# Altium project PCB_Project1.PrjPCB
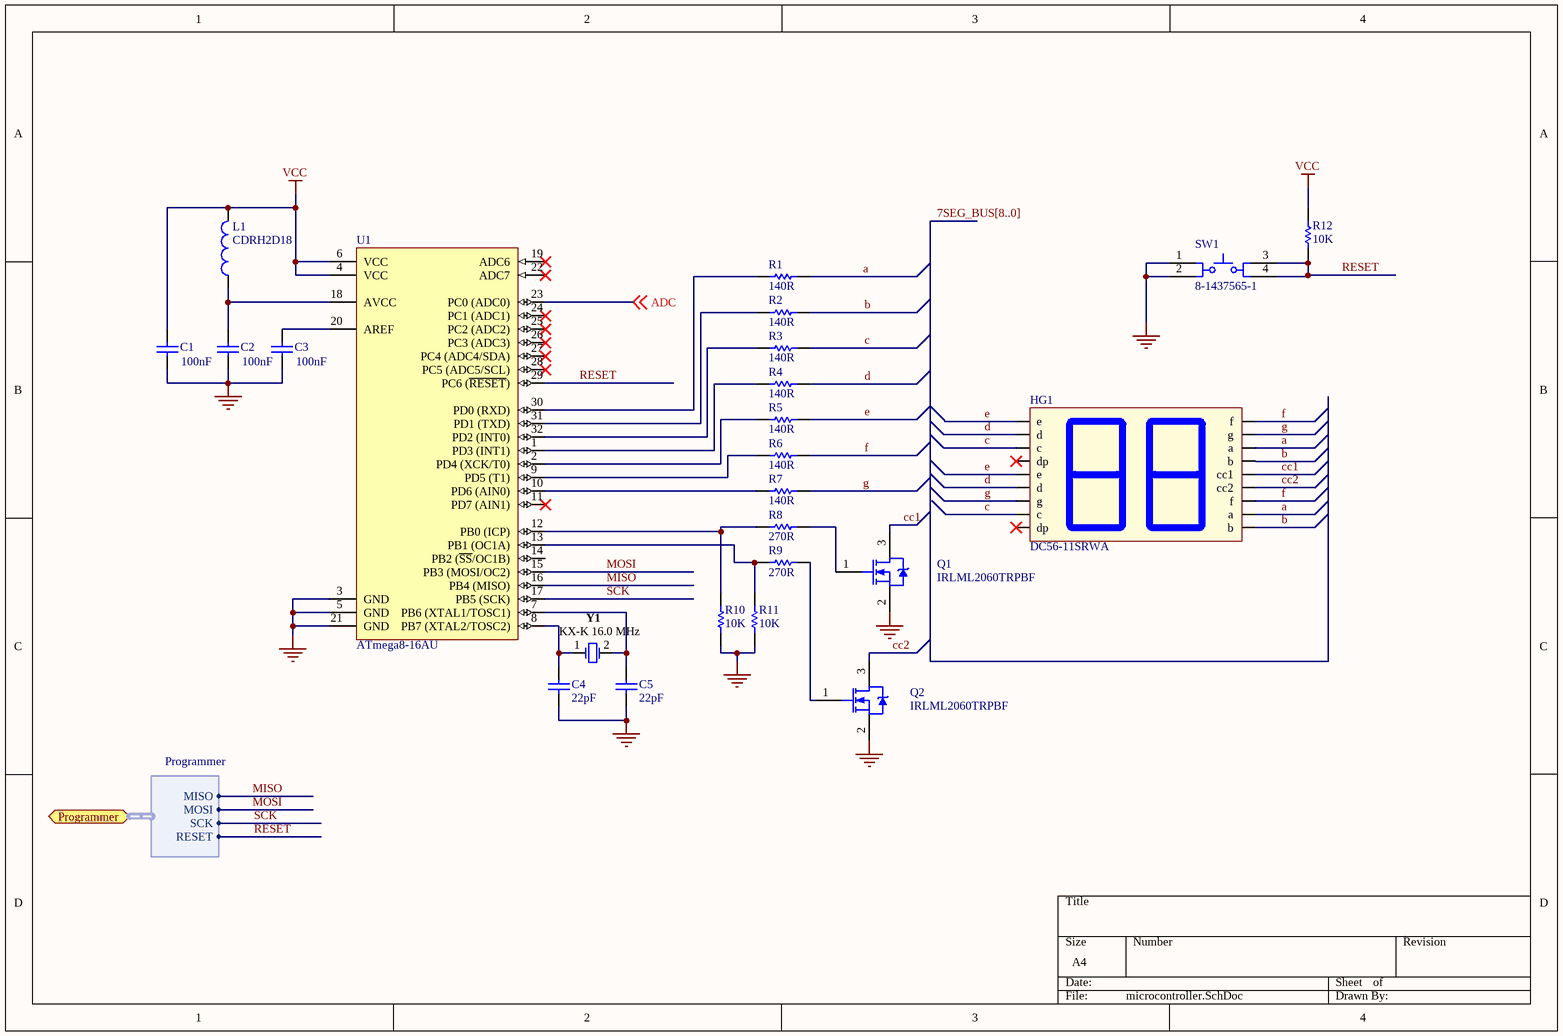
[diagram p0: microcontroller.SchDoc]
4 sheets, 38 parts. Net scope: flat (ports and power ports of the same name join across sheets).
Board file: PCB1.PcbDoc
Sheets:
  microcontroller.SchDoc
  OA.SchDoc
  pm.SchDoc
  programmer.SchDoc

## Sheet microcontroller.SchDoc
size A4

### Parts
C1  100nF  [CAPC0805(2012)75_M]
C2  100nF  [CAPC0805(2012)75_M]
C3  100nF  [CAPC0805(2012)75_M]
C4  22pF  [CAPC0805(2012)100_M]
C5  22pF  [CAPC0805(2012)100_M]
HG1  DC56-11SRWA  [7seg_LCD]
L1  CDRH2D18  [SUMI-CDRH2D14NP-1R5NC-2_V]
Q1  IRLML2060TRPBF  [INTR-IRLML2402TRPBF-3_V]
Q2  IRLML2060TRPBF  [INTR-IRLML2402TRPBF-3_V]
R1  140R  [RESC0805(2012)_M]
R2  140R  [RESC0805(2012)_M]
R3  140R  [RESC0805(2012)_M]
R4  140R  [RESC0805(2012)_M]
R5  140R  [RESC0805(2012)_M]
R6  140R  [RESC0805(2012)_M]
R7  140R  [RESC0805(2012)_M]
R8  270R  [RESC0805(2012)_M]
R9  270R  [RESC0805(2012)_M]
R10  10K  [RESC0805(2012)_M]
R11  10K  [RESC0805(2012)_M]
R12  10K  [RESC0805(2012)_M]
SW1  8-1437565-1  [SW-SPST-NO-4]
U1  ATmega8-16AU  [32A_L]
Y1  KX-K 16.0 MHz  [FOX-HC49SDLF_V]

### Ports
Programmer (harness Programmer)

### Harnesses
Programmer: MISO, MOSI, SCK, RESET

### Nets
GND: C1.1 C2.1 C3.1 C4.1 C5.1 Q1.2(S) Q2.2(S) R10.1 R11.1 SW1.1 SW1.2 U1.3(GND) U1.5(GND) U1.21(GND)
VCC: C1.2 L1.2 R12.2 U1.4(VCC) U1.6(VCC)
a: HG1.11(a) HG1.16(a) R1.2
ADC: U1.23(PC0_(ADC0)) ; off-sheet ADC
b: HG1.10(b) HG1.15(b) R2.2
c: HG1.3(c) HG1.8(c) R3.2
cc1: HG1.14(cc1) Q1.3(D)
cc2: HG1.13(cc2) Q2.3(D)
d: HG1.2(d) HG1.6(d) R4.2
e: HG1.1(e) HG1.5(e) R5.2
f: HG1.12(f) HG1.18(f) R6.2
g: HG1.7(g) HG1.17(g) R7.2
MISO: U1.16(PB4_(MISO)) ; port Programmer.MISO
MOSI: U1.15(PB3_(MOSI/OC2)) ; port Programmer.MOSI
RESET: R12.1 SW1.3 SW1.4 U1.29(PC6_(~{RESET})) ; port Programmer.RESET
SCK: U1.17(PB5_(SCK)) ; port Programmer.SCK
NetC2_2: C2.2 L1.1 U1.18(AVCC)
NetC3_2: C3.2 U1.20(AREF)
NetC4_2: C4.2 U1.8(PB7_(XTAL2/TOSC2)) Y1.1
NetC5_2: C5.2 U1.7(PB6_(XTAL1/TOSC1)) Y1.2
NetQ1_1: Q1.1(G) R8.2
NetQ2_1: Q2.1(G) R9.2
NetR1_1: R1.1 U1.30(PD0_(RXD))
NetR2_1: R2.1 U1.31(PD1_(TXD))
NetR3_1: R3.1 U1.32(PD2_(INT0))
NetR4_1: R4.1 U1.1(PD3_(INT1))
NetR5_1: R5.1 U1.2(PD4_(XCK/T0))
NetR6_1: R6.1 U1.9(PD5_(T1))
NetR7_1: R7.1 U1.10(PD6_(AIN0))
NetR8_1: R8.1 R10.2 U1.12(PB0_(ICP))
NetR9_1: R9.1 R11.2 U1.13(PB1_(OC1A))

Not connected (* = marked no-connect by the designer): HG1 4(dp)* 9(dp)*; U1 11(PD7_(AIN1))* 14(PB2_(~{SS}/OC1B)) 19(ADC6)* 22(ADC7)* 24(PC1_(ADC1))* 25(PC2_(ADC2))* 26(PC3_(ADC3))* 27(PC4_(ADC4/SDA))* 28(PC5_(ADC5/SCL))*

### Buses and harness runs
bus 7SEG_BUS[8..0]

### Library data of the parts
C1-C3 = CMP-1036-04403-1: CAP 100nF 16V ±20% 0805 (2012 Metric) Thickness 0.75mm SMD; Case-EIA: 0805; Tolerance: Â±20%; Case-Metric: 2012; Rated Voltage: 16 V; Value: 100nF; Technology: SMT; Max Thickness: 0.75 mm
C4 C5 = CMP-1036-01214-1: CAP 22pF 16V ±0.25pF 0805 (2012 Metric) Thickness 1mm SMD; Case-EIA: 0805; Tolerance: Â±0.25pF; Case-Metric: 2012; Technology: SMT; Value: 22pF; Max Thickness: 1 mm; Rated Voltage: 16 V
HG1 = Component_1
L1 = CMP-0468-00001-2: Power Inductor,-40 to 100 degC, 3.2 x 3.2 x 1.55 mm, SMD; PartNumber: CDRH2D14NP-1R5NC; Manufacturer: Sumida; Saturation Current(A)at 20 degC: 1.8; Stamp: A; Inductance(uH)[within]: 1.5+/- 30%; Saturation Current(A)at 100degC: 1.2; Temperature Rise Current(A): 2; Packing: Tape and Reel; D.C.R.(mOhm) Max.(Typ.)(at 20 degC): 63(50); ComponentLink1URL: http://www.sumida.com; DatasheetVersion: 17.09.12; ComponentLink2Description: Datasheet; ComponentLink2URL: http://www.sumida.com/products/pdf/CDRH2D14.pdf; ComponentLink3URL: http://www.sumida.com/products/pdf/CDRH2D14.pdf; ComponentLink1Description: Manufacturer URL; ComponentLink3Description: Package Specification; Mounting Technology: Surface Mount; Operating Temperature range: -40 to 100 degC; PackageDescription: 2-Pin Hand Drawn, Body 3 x 3mm, Pitch 3 mm; PackageReference: CDRH2D14NP-1R5NC-2
Q1 Q2 = CMP-2000-05155-1: HEXFET(R) Power MOSFET, N-Channel, 20 V, 1.2 A, 3-Pin SOT-23, RoHS, Tape and Reel; Manufacturer: International Rectifier; Voltage Vgs Rds on Measurement: 4.5V; Current Id Max: 1.2A; External Width: 3.05mm; Transistor Polarity: NChannel; No. of Pins: 3; Power Dissipation Pd: 540mW; External Length / Height: 1.12mm; Full Power Rating Temperature: 25degC; On Resistance Rds(on): 250mohm; Voltage Vds Typ: 20V; SMD Marking: 1A; No. of Transistors: 1; Reel Quantity: 3000; External Depth: 2.5mm; Pulse Current Idm: 7.4A; Junction Temperature Tj Min: -55degC; Threshold Voltage Vgs Typ: 700mV; SVHC: NoSVHC(19-Dec-2012); Datasheet URL: https://datasheet.ciiva.com/29326/162826-da-01-en-irlml-2402tr-29326791.pdf; Tape Width: 8mm; Operating Temperature Range: -55degCto+150degC; Manufacturer URL: http://internationalrectifier.com/; Termination Type: SMD; Datasheet Version: Jan-03; Current Temperature: 25degC; Package / Case: SOT-23; Drain Source Voltage Vds: 20V; Rds(on) Test Voltage Vgs: 4.5V; Continuous Drain Current Id: 1.2A; Transistor Case Style: SOT-23; Voltage Vgs th Min: 700mV; Voltage Vgs Max: 700mV
R1-R7 = CMP-1013-00412-1: 140R 0.125W 1% 0805 (2012 Metric)  SMD; Value: 140.00 Ohm; Case-Metric: 2012; Case-EIA: 0805; Power: 0.125 W; Technology: SMT; Tolerance: 1 %
R8 R9 = CMP-1013-00060-1: 270R 0.125W 5% 0805 (2012 Metric)  SMD; Value: 270.00 Ohm; Case-Metric: 2012; Case-EIA: 0805; Power: 0.125 W; Technology: SMT; Tolerance: 5 %
R10-R12 = CMP-1013-00098-1: 10K 0.125W 5% 0805 (2012 Metric)  SMD; Case-EIA: 0805; Case-Metric: 2012; Value: 10000.00 Ohm; Power: 0.125 W; Technology: SMT; Tolerance: 5 %
SW1 = SW-SPST-NO-4
U1 = CMP-0095-00565-1: 8-bit AVR Microcontroller, 4.5-5.5V, 16MHz, 8KB Flash, 512 Bytes EEPROM, 1KB SRAM, 32-pin TQFP, Industrial Grade (-40°C to 85°C); ComponentLink3Description: ATmega8(L) Summary; ComponentLink1Description: Manufacturer URL; ComponentLink2Description: ATmega8(L); DatasheetVersion: revZ, Feb-2011; PackageReference: 32A; ComponentLink2URL: http://www.atmel.com/dyn/resources/prod_documents/doc2486.pdf; ComponentLink1URL: http://www.atmel.com/; Code_JEDEC: MS-026-ABA; PackageDescription: 32-Lead, 7x7x1.0 mm Body, 0.8mm Lead Pitch, Thin Profile Plastic Quad Flat Package (TQFP); ComponentLink3URL: http://www.atmel.com/dyn/resources/prod_documents/2486S.pdf; PackageVersion: revC, Oct-2010
Y1 = CMP-2100-03639-1: Resistance Weld Crystal, 8 MHz, +/- 30 ppm, -20 to 70 degC, 2-Pin SMD, RoHS, Tape and Reel; Manufacturer: FOX Electronics; Series Resistance: 80Ohm; Frequency: 8MHz; Load Capacitance: 20pF; Tolerance: 50ppm; Frequency Tolerance: 30ppm; Datasheet URL: http://www.foxonline.com/pdfs/hc49sdlf.pdf; Package Reference: HC49SDLF; Height: 4.5mm; Mount: SurfaceMount; Packaging: TapeandReel; Length: 11.7mm; Termination: SMD/SMT; Number of Pins: 2; Depth: 5mm; Min Operating Temperature: -20degC; Package Quantity: 1000; RoHSCompliant: True; Lead Free: LeadFree; Width: 5mm; Case/Package: SMD/SMT; Manufacturer URL: http://www.foxonline.com/; Max Operating Temperature: 70degC; REACH SVHC: NoSVHC; Datasheet Version: 42064.0; Package Description: 2-Pin Surface Mount Device, Body 5 x 11.7 mm; Frequency Stability: 50ppm; ESR (Equivalent Series Resistance): 80Ohm; Radiation Hardening: No

## Sheet OA.SchDoc
size A4
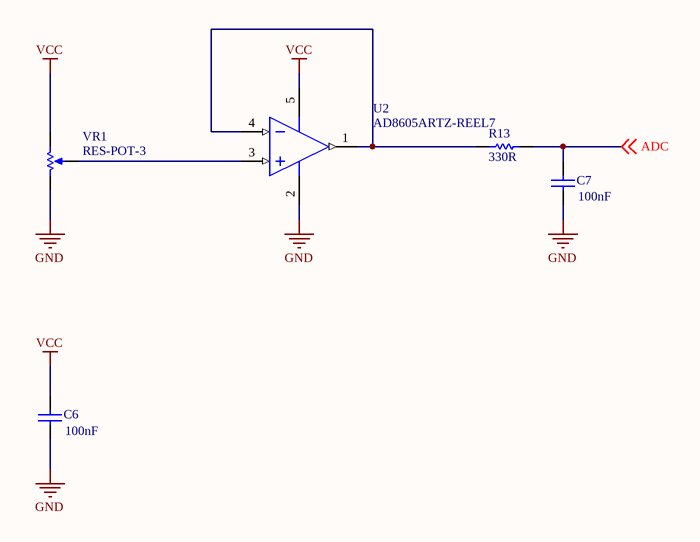
[diagram p1: OA.SchDoc]

### Parts
C6  100nF  [CAPC0805(2012)75_M]
C7  100nF  [CAPC0805(2012)75_M]
R13  330R  [RESC0805(2012)_M]
U2  AD8605ARTZ-REEL7  [ADI-RJ-5_M]
VR1  RES-POT-3  [RES-POT-3]

### Nets
GND: C6.1 C7.1 U2.2(-V) VR1.3(CW)
VCC: C6.2 U2.5(+V) VR1.1(CCW)
ADC: C7.2 R13.2 ; off-sheet ADC
NetR13_1: R13.1 U2.1(OUT) U2.4(-IN)
NetU2_3: U2.3(+IN) VR1.2(S)

### Library data of the parts
C6 C7 = CMP-1036-04403-1: as C1 on sheet microcontroller; Rated Voltage: 16 V; Value: 100nF; Technology: SMT; Max Thickness: 0.75 mm
R13 = CMP-1013-00062-1: 330R 0.125W 5% 0805 (2012 Metric)  SMD; Value: 330.00 Ohm; Case-EIA: 0805; Case-Metric: 2012; Tolerance: 5 %; Power: 0.125 W; Technology: SMT
U2 = CMP-0384-01494-2: Single Channel Wide Bandwidth Operational Amplifier, 10 MHz BW, 5 V/us SR, Industrial, 5-pin SOT23 (RJ-5), Reel; Manufacturer: Analog Devices; Generic Part Number: AD8605; Input Offset Voltage: 20uV; V Span Min: 2.7V; Input Bias Current: 200fA; Slew Rate: 5V/us; V Span Max: 6V; Small Signal Bandwidth: 10MHz; Amplifiers Per Package: 1; Iq/Amp: 1.2mA; ComponentLink2Description: Datasheet; PackageVersion: 121608-A; Mounting Technology: Surface Mount; ComponentLink3URL: http://www.analog.com/static/imported-files/packages/PKG_PDF/SOT-23(RJ)/RJ_5.pdf; Code_JEDEC: MO-178-AA; ComponentLink1Description: Manufacturer URL; ComponentLink4Description: Reference Circuit; RevisionNote: Reference Circuit URL fixed; PartNumber: AD8605ARTZ-REEL7; DatasheetVersion: Rev. L; PackageDescription: 5-Pin Small Outline Transistor Package, Body 2.9 x 1.6 mm, Pitch 0.95 mm; ComponentLink4URL: http://www.analog.com/en/all-operational-amplifiers-op-amps/operational-amplifiers-op-amps/ad8605/products/product.html#product-recommendations; ComponentLink3Description: Package Specification; ComponentLink1URL: http://www.analog.com/en/index.html; PackageReference: RJ-5; ComponentLink2URL: http://www.analog.com/static/imported-files/data_sheets/AD8605_8606_8608.pdf
VR1 = RES-POT-3: Potentiometer: 10K

## Sheet pm.SchDoc
size A4
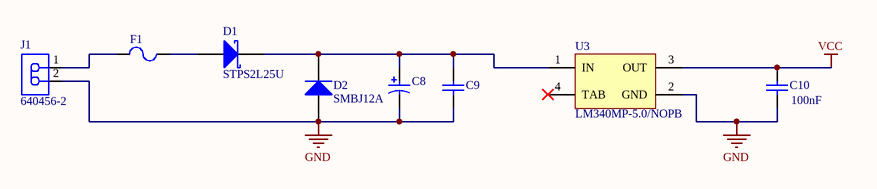
[diagram p2: pm.SchDoc]

### Parts
C8  293D476X0025D2TE3  [AVX-7343-31_M]  (value not drawn)
C9  330pF  [CAPC0805(2012)100_M]  (value not drawn)
C10  100nF  [CAPC0805(2012)75_M]
D1  STPS2L25U  [STM-SMB_P_V]
D2  SMBJ12A  [FAIR-DO-214AA-2_V]
F1  1210L050YR  [fuse - duplicate]  (value not drawn)
J1  640456-2  [TECO-640456-2_V]
U3  LM340MP-5.0/NOPB  [DCY0004A_L]

### Nets
GND: C8.2 C9.1 C10.1 D2.1(A) J1.2 U3.2(GND)
VCC: C10.2 U3.3(OUT)
NetC8_1: C8.1 C9.2 D1.2(K) D2.2(K) U3.1(IN)
NetD1_1: D1.1(A) F1.2
NetF1_1: F1.1 J1.1

Not connected (* = marked no-connect by the designer): U3 4(TAB)*

### Library data of the parts
C8 = CMP-2000-07307-1: Tantalum Capacitor, 47 uF, +/- 10%, 25 V, -55 to 125 degC, 2-Pin SMD, Tape and Reel; Mfr Case Code: DCase; Brand: AVX; Leakage Current: 11.8uA; Dissipation Factor DF: 6; Ripple Current: 0.4mA; Voltage Rating: 25V; Qualification: Commercial; Unit Weight: 0.023634oz; ESR: 150mOhms; Capacitance: 47uF; Product: TantalumSolidLowESRStandardGrade; Case Code - mm: 7343; Manufacturer URL: http://www.avx.com/; Datasheet Version: 02/2004; Length: 7.3mm; Packaging: Reel; Mounting Technology: SurfaceMount; Minimum Operating Temperature: -55C; Maximum Operating Temperature: +125C; Series: TPS; Case Code - in: 2917; Height: 3.1mm; Package Description: 2-Pin Surface Mount Device, Body 7.3 x 4.35 mm; Operating Temperature Range: -55Cto+125C; Product Category: TantalumCapacitors-SolidSMD; RoHS: True; Tolerance: 10%; Package / Case: 2917(7343metric); Package Reference: 7343-31; Termination Style: SMD/SMT; Width: 4.3mm; Datasheet URL: https://datasheet.ciiva.com/11793/0900766b80066cb4-11793194.pdf; Manufacturer: AVX
C9 = CMP-1036-02496-1: CAP 330pF 50V ±1% 0805 (2012 Metric) Thickness 1mm SMD; Case-EIA: 0805; Case-Metric: 2012; Tolerance: Â±1%; Value: 330pF; Rated Voltage: 50 V; Technology: SMT; Max Thickness: 1 mm
C10 = CMP-1036-04403-1: as C1 on sheet microcontroller; Rated Voltage: 16 V; Value: 100nF; Technology: SMT; Max Thickness: 0.75 mm
D1 = CMP-2000-07176-1: Low Drop Power Schottky Rectifier, 2 A, 25 V, 2-Pin SMD (SMB), RoHS, Tape and Reel; Manufacturer: STMicroelectronics; Speed: FastRecovery=200mA(Io); Voltage - Forward (Vf) (Max) @ If: 450mV@2A; Other Related Documents: STPS2L25ViewAllSpecifications; Online Catalog: SchottkyDiode; Current - Average Rectified (Io): 2A; Current - Reverse Leakage @ Vr: 90µA@25V; Voltage - DC Reverse (Vr) (Max): 25V; Other Names: 497-5573-6; Manufacturer URL: http://www.st.com/; Series: -; Capacitance @ Vr, F: -; Reverse Recovery Time (trr): -; Category: DiscreteSemiconductorProducts; Diode Type: Schottky; Datasheet URL: http://www.st.com/content/ccc/resource/technical/document/datasheet/f9/71/8b/51/48/04/4b/9b/CD00001325.pdf/files/CD00001325.pdf/jcr:content/translations/en.CD00001325.pdf; Package Description: 2-Pin Surface Mount Device, Body 4.325 x 3.625 mm; Mounting Technology: SurfaceMount; Operating Temperature - Junction: 150°C(Max); Datasheet Version: 02/2007; Package / Case: DO-214AA,SMB; Mounting Type: SurfaceMount; Family: Diodes,Rectifiers-Single; Package URL: http://www.st.com/st-web-ui/static/active/en/resource/technical/document/datasheet/CD00279657.pdf; Package Reference: SMB_P; Standard Package: 1; Packaging: Digi-Reel®; Supplier Device Package: SMB
D2 = CMP-2000-07093-1: Transient Voltage Suppressor Diode, 600 W, -55 to 150 degC, 2-Pin SMB (DO-214AA), RoHS, Tape and Reel; Manufacturer: Fairchild Semiconductor; Unidirectional Channels: 1; EDA / CAD Models: DownloadfromAcceleratedDesigns; Type: Zener; Power - Peak Pulse: 600W; Power Line Protection: No; Online Catalog: SMBJSeries; Voltage - Breakdown (Min): 13.3V; Voltage - Clamping (Max) @ Ipp: 19.9V; Other Names: SMBJ12AFSDKR; Current - Peak Pulse (10/1000µs): 30.2A; Voltage - Reverse Standoff (Typ): 12V; Package / Case: DO-214AA,SMB; Mounting Technology: SurfaceMount; Standard Package: 1; Capacitance @ Frequency: -; Category: CircuitProtection; Supplier Device Package: DO-214AA(SMB); Mounting Type: SurfaceMount; Series: SMBJ; Family: TVS-Diodes; Datasheet Version: Rev. 1.1.1, 11/2014; Package Reference: DO-214AA-2; Package Description: 2-Pin Surface Mount Device, Body 4.4 x 3.625 mm; Packaging: Digi-Reel®; Bidirectional Channels: -; Manufacturer URL: https://www.fairchildsemi.com/; Applications: GeneralPurpose; Operating Temperature: -55°C~150°C(TJ); Datasheet URL: http://www.mouser.com/ds/2/149/SMBJ12A-196559.pdf
F1 = FUSE
J1 = CMP-2000-05417-1: Male Header, Pitch 2.54 mm, 1 x 2 Position, Height 10.49 mm, Tail Length 3.556 mm, -55 to 105 degC, RoHS, Bulk; Manufacturer: TE Connectivity; Standards: RoHSCompliant,ELVCompliant,UL94V-0; Material, Housing: Polyester; Agency Approvals: CSA,UL; Brand/Series: MTA-100Series; Contact Centerline Spacing: 0.100 / in.; Material, Contact: CopperAlloy; Current, Rating: 5 / A; Color, Housing: White; Contact Termination Area Plating: Tin; Special Features: Pinstrip; Number of Positions: 2; Temperature, Operating: -55to+105 / degC; Angle: Straight; Mount Angle: Vertical; Connector Type: MTA-100; Primary Type: InterconnectSystem; Voltage, Rating: 250 / V; Number of Rows: 1; Termination: Solder; Length, Terminal Post: 0.14 / in.; Manufacturer URL: http://www.te.com/; Color: White; Size, Post: 0.025 / in.; Contact Shape: Square; Mounting Type: PCMount; Datasheet URL: https://datasheet.ciiva.com/11746/0900766b80eb7fdd-11746365.pdf; Type: PCBPlug; Datasheet Version: Rev. W, 06/2004; Number of Contacts: 2; Flammability Rating: UL94V-0; Contact Plating: Tin; Contact Mating Area Plating: Tin
U3 = CMP-0062-01784-3: Series 3-Terminal Positive Regulators, 4-pin SOT-223, Pb-Free; Manufacturer: Texas Instruments; PowerWise: N; CompType: LDO IC; PackageTopMarking: XYTT*N00A; Code_IPC: SOT223-4; PackageReference: DCY0004A; ComponentLink1Description: Datasheet URL; PackageDescription: Molded SOT-223, 6.50 x 3.56 x 1.6mm Body, 4 Lead, 2.3mm Pitch; PinCount: 4; RoHS: Y; ComponentLink1URL: http://www.ti.com/general/docs/lit/getliterature.tsp?genericPartNumber=LM340-N&fileType=pdf; Code_JEDEC: TO-261-AA

## Sheet programmer.SchDoc
size A4
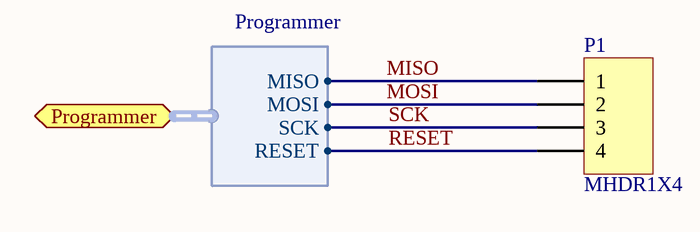
[diagram p3: programmer.SchDoc]

### Parts
P1  MHDR1X4  [MHDR1X4]

### Ports
Programmer (harness Programmer)

### Harnesses
Programmer: MISO, MOSI, SCK, RESET

### Nets
MISO: P1.1 ; port Programmer.MISO
MOSI: P1.2 ; port Programmer.MOSI
RESET: P1.4 ; port Programmer.RESET
SCK: P1.3 ; port Programmer.SCK

### Library data of the parts
P1 = MHDR1X4: Header, 4-Pin; LatestRevisionDate: 17-Jul-2002; LatestRevisionNote: Re-released for DXP Platform.; Publisher: Altium Limited

## Nets that join several sheets
GND: microcontroller (14 pins), OA (C6.1 C7.1 U2.2 VR1.3), pm (6 pins)
VCC: microcontroller (5 pins), OA (C6.2 U2.5 VR1.1), pm (C10.2 U3.3)
ADC: microcontroller (U1.23), OA (C7.2 R13.2)
MISO: microcontroller (U1.16), programmer (P1.1)
MOSI: microcontroller (U1.15), programmer (P1.2)
RESET: microcontroller (R12.1 SW1.3 SW1.4 U1.29), programmer (P1.4)
SCK: microcontroller (U1.17), programmer (P1.3)